# Altium project Artemis_Plus.PrjPcb
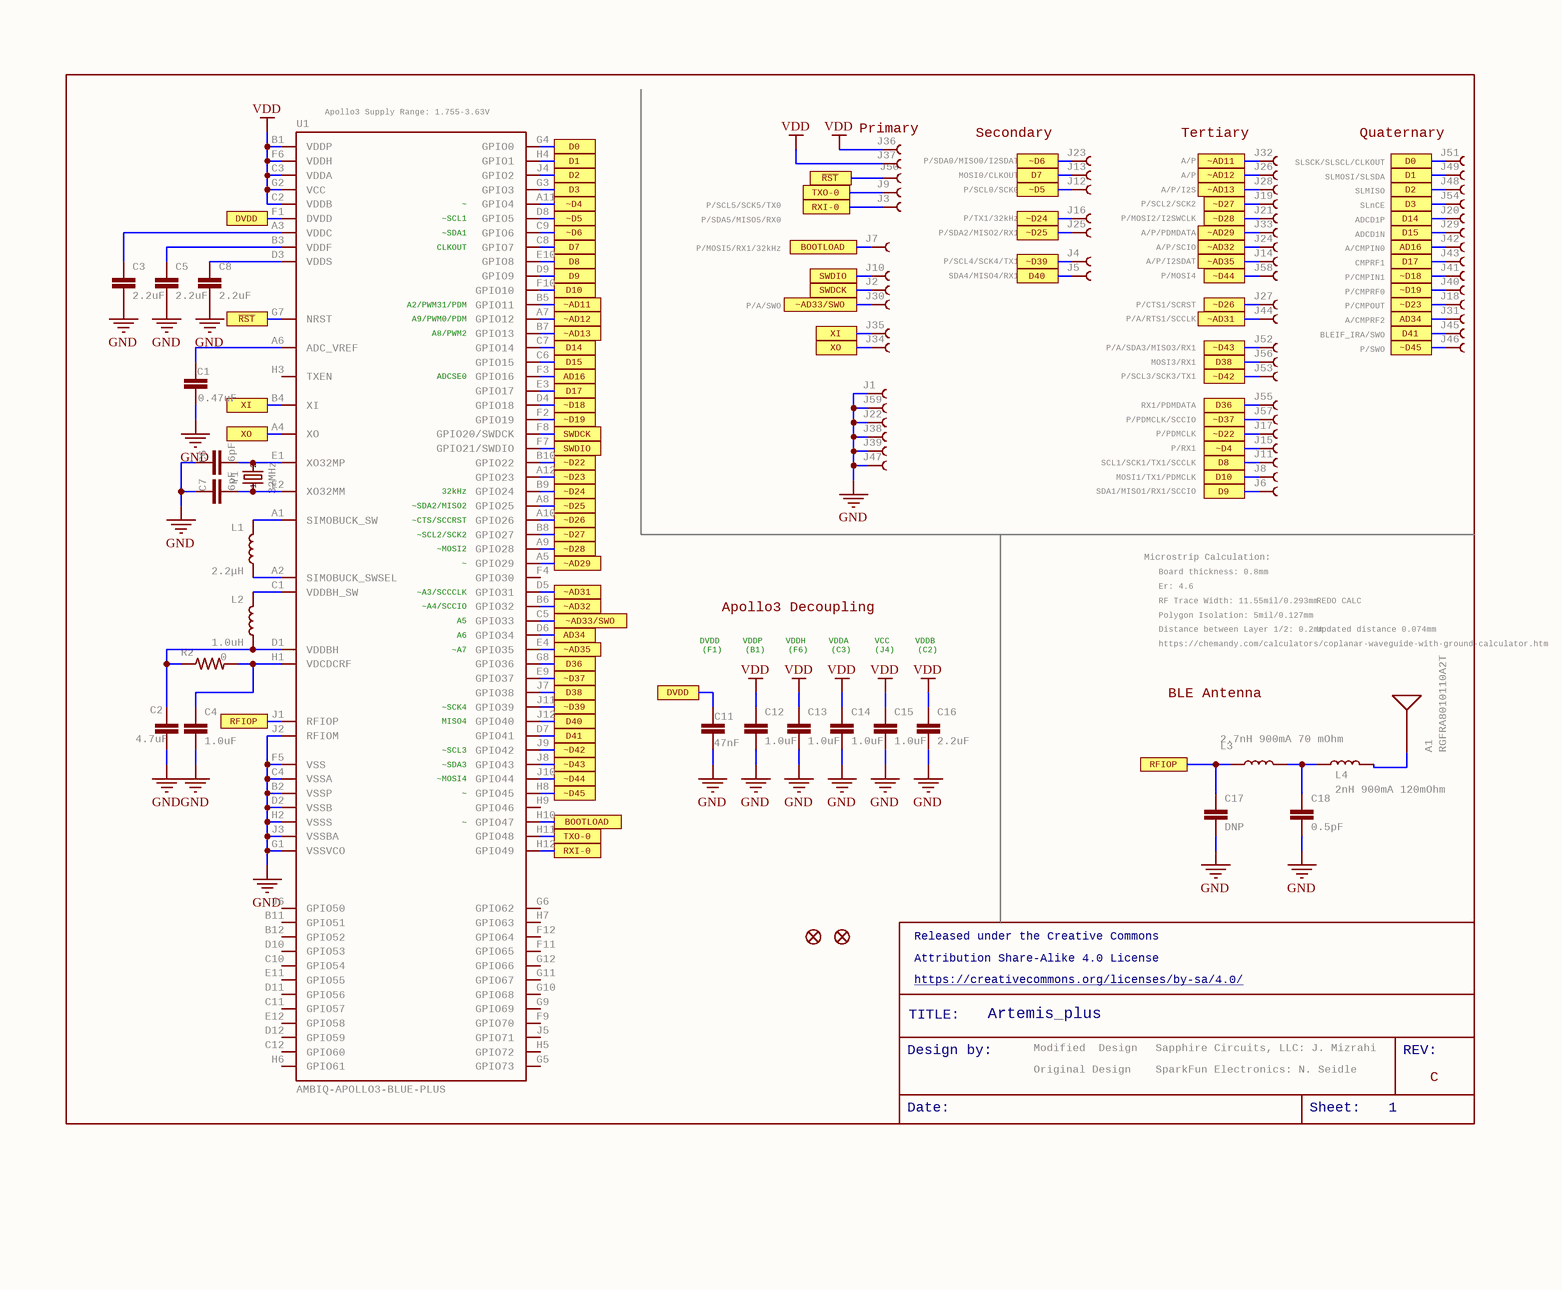
[diagram p0: Artemis_Plus.SchDoc]
CircuitCardAssemblyNumber: 1012; ContactEmail: jared@sapphirecircuits.com; ContactName: Jared Mizrahi; PrintedWireBoardNumber: 1011; Project: SCH, Artemis Plus; ProjectTitle: Artemis Plus; SchematicNumber: 1010; VersionRevision: C
1 sheet, 85 parts. Net scope: global (net labels, ports and power ports of the same name join across sheets).
Board file: Artemis_Plus.PcbDoc

## Sheet Artemis_Plus.SchDoc: Artemis_plus
size 274 x 226 mm; Origin: Eagle; Date: 11/12/2022 4:39:07 PM; SheetNumber: 1; DESIGNER: DESIGNER; REV: REV; GateName_1: G$1; SymbolName_1: FRAME-LETTER; LibraryName: SparkFun-Aesthetics; DeviceSetName: FRAME-LETTER; GateName_2: V; SymbolName_2: DOCFIELD; Sheet: Sheet:; ReleasedundertheCreativeCommons: Released under the Creative Commons; AttributionShare-Alike4.0License: Attribution Share-Alike 4.0 License; https://creativecommons.org/licenses/by-sa/4.0/: https://creativecommons.org/licenses/by-sa/4.0/; Designby: Design by:

### Parts
A1  RGFRA8010110A2T  [RGFRA8010110A2T]
C1  0.47uF  [0402-TIGHT-C]
C2  4.7uF  [0402-TIGHT-C]
C3  2.2uF  [0402-TIGHT-C]
C4  1.0uF  [0402-TIGHT-C]
C5  2.2uF  [0402-TIGHT-C]
C6  6pF  [0402-TIGHT-C]
C7  6pF  [0402-TIGHT-C]
C8  2.2uF  [0402-TIGHT-C]
C11  47nF  [0402-TIGHT-C]
C12  1.0uF  [0402-TIGHT-C]
C13  1.0uF  [0402-TIGHT-C]
C14  1.0uF  [0402-TIGHT-C]
C15  1.0uF  [0402-TIGHT-C]
C16  2.2uF  [0402-TIGHT-C]
C17  DNP  [0402-TIGHT]
C18  0.5pF  [0402-TIGHT-C]
FD1  FIDUCIAL0.4MM  [FIDUCIAL-0.4MM]  (value not drawn)  (no BOM)
FD2  FIDUCIAL0.4MM  [FIDUCIAL-0.4MM]  (value not drawn)  (no BOM)
J1  PAD.4X.6  [MODULE_PAD]  (value not drawn)  (no BOM)
J2  PAD.4X.6  [MODULE_PAD]  (value not drawn)  (no BOM)
J3  PAD.4X.6  [MODULE_PAD]  (value not drawn)  (no BOM)
J4  PAD.4X.6  [MODULE_PAD]  (value not drawn)  (no BOM)
J5  PAD.4X.6  [MODULE_PAD]  (value not drawn)  (no BOM)
J6  PAD.4X.6  [MODULE_PAD]  (value not drawn)  (no BOM)
J7  PAD.4X.6  [MODULE_PAD]  (value not drawn)  (no BOM)
J8  PAD.4X.6  [MODULE_PAD]  (value not drawn)  (no BOM)
J9  PAD.4X.6  [MODULE_PAD]  (value not drawn)  (no BOM)
J10  PAD.4X.6  [MODULE_PAD]  (value not drawn)  (no BOM)
J11  PAD.4X.6  [MODULE_PAD]  (value not drawn)  (no BOM)
J12  PAD.4X.6  [MODULE_PAD]  (value not drawn)  (no BOM)
J13  PAD.4X.6  [MODULE_PAD]  (value not drawn)  (no BOM)
J14  PAD.4X.6  [MODULE_PAD]  (value not drawn)  (no BOM)
J15  PAD.4X.6  [MODULE_PAD]  (value not drawn)  (no BOM)
J16  PAD.4X.6  [MODULE_PAD]  (value not drawn)  (no BOM)
J17  PAD.4X.6  [MODULE_PAD]  (value not drawn)  (no BOM)
J18  PAD.4X.6  [MODULE_PAD]  (value not drawn)  (no BOM)
J19  PAD.4X.6  [MODULE_PAD]  (value not drawn)  (no BOM)
J20  PAD.4X.6  [MODULE_PAD]  (value not drawn)  (no BOM)
J21  PAD.4X.6  [MODULE_PAD]  (value not drawn)  (no BOM)
J22  (no value)  [MODULE_MINI_PAD]  (no BOM)
J23  PAD.4X.6  [MODULE_PAD]  (value not drawn)  (no BOM)
J24  PAD.4X.6  [MODULE_PAD]  (value not drawn)  (no BOM)
J25  PAD.4X.6  [MODULE_PAD]  (value not drawn)  (no BOM)
J26  PAD.4X.6  [MODULE_PAD]  (value not drawn)  (no BOM)
J27  PAD.4X.6  [MODULE_PAD]  (value not drawn)  (no BOM)
J28  PAD.4X.6  [MODULE_PAD]  (value not drawn)  (no BOM)
J29  PAD.4X.6  [MODULE_PAD]  (value not drawn)  (no BOM)
J30  PAD.4X.6  [MODULE_PAD]  (value not drawn)  (no BOM)
J31  PAD.4X.6  [MODULE_PAD]  (value not drawn)  (no BOM)
J32  PAD.4X.6  [MODULE_PAD]  (value not drawn)  (no BOM)
J33  PAD.4X.6  [MODULE_PAD]  (value not drawn)  (no BOM)
J34  PAD.4X.6  [MODULE_PAD]  (value not drawn)  (no BOM)
J35  PAD.4X.6  [MODULE_PAD]  (value not drawn)  (no BOM)
J36  PAD.4X.6  [MODULE_PAD]  (value not drawn)  (no BOM)
J37  PAD.4X.6  [MODULE_PAD]  (value not drawn)  (no BOM)
J38  PAD.6X.6  [MODULE_MINI_PAD]  (value not drawn)  (no BOM)
J39  PAD.4X.6  [MODULE_PAD]  (value not drawn)  (no BOM)
J40  PAD.4X.6  [MODULE_PAD]  (value not drawn)  (no BOM)
J41  PAD.4X.6  [MODULE_PAD]  (value not drawn)  (no BOM)
J42  PAD.4X.6  [MODULE_PAD]  (value not drawn)  (no BOM)
J43  PAD.4X.6  [MODULE_PAD]  (value not drawn)  (no BOM)
J44  PAD.4X.6  [MODULE_PAD]  (value not drawn)  (no BOM)
J45  PAD.4X.6  [MODULE_PAD]  (value not drawn)  (no BOM)
J46  PAD.4X.6  [MODULE_PAD]  (value not drawn)  (no BOM)
J47  PAD.4X.6  [MODULE_PAD]  (value not drawn)  (no BOM)
J48  PAD.4X.6  [MODULE_PAD]  (value not drawn)  (no BOM)
J49  PAD.4X.6  [MODULE_PAD]  (value not drawn)  (no BOM)
J50  PAD.4X.6  [MODULE_PAD]  (value not drawn)  (no BOM)
J51  PAD.4X.6  [MODULE_PAD]  (value not drawn)  (no BOM)
J52  PAD.4X.6  [MODULE_PAD]  (value not drawn)  (no BOM)
J53  PAD.4X.6  [MODULE_PAD]  (value not drawn)  (no BOM)
J54  PAD.4X.6  [MODULE_PAD]  (value not drawn)  (no BOM)
J55  PAD.4X.6  [MODULE_PAD]  (value not drawn)  (no BOM)
J56  PAD.4X.6  [MODULE_PAD]  (value not drawn)  (no BOM)
J57  PAD.4X.6  [MODULE_PAD]  (value not drawn)  (no BOM)
J58  PAD.4X.6  [MODULE_PAD]  (value not drawn)  (no BOM)
J59  PAD.4X.6  [MODULE_PAD]  (value not drawn)  (no BOM)
L1  2.2μH  [DFE201610E-2R2MP2]
L2  1.0uH  [LQM21PN1R0MEHD]
L3  2.7nH 900mA 70 mOhm  [0402-TIGHT-L]
L4  2nH 900mA 120mOhm  [0402-TIGHT-L]
R2  0  [0402-TIGHT-R]
U1  AMBIQ-APOLLO3-BLUE-PLUS  [BGA-104-5.3X4.3MM - Sprite-mixed-0.2-0.19 - 3DModel]
Y1  32MHz  [ECS-320-6-37B2-CKM-TR]

### Ports
AD16, AD34, BOOTLOAD, D0, D1, D2, D3, D7, D8, D9, D10, D14, D15, D17, D36, D38, D40, D41, DVDD, RFIOP, RXI-0, SWDCK, SWDIO, TXO-0, XI, XO, ~AD11, ~AD12, ~AD13, ~AD29, ~AD31, ~AD32, ~AD33/SWO, ~AD35, ~D4, ~D5, ~D6, ~D18, ~D19, ~D22, ~D23, ~D24, ~D25, ~D26, ~D27, ~D28, ~D37, ~D39, ~D42, ~D43, ~D44, ~D45, ~{RST}

### Nets
GND: C1.2 C2.2 C3.2 C4.2 C5.2 C6.1 C7.1 C8.2 C11.2 C12.2 C13.2 C14.2 C15.2 C16.2 C17.2 C18.2 J1.1 J22.1 J38.1 J39.1 J47.1 J59.1 U1.B2(VSSP) U1.C4(VSSA) U1.D2(VSSB) U1.F5(VSS) U1.G1(VSSVCO) U1.H2(VSSS) U1.J2(RFIOM) U1.J3(VSSBA)
VDD: C12.1 C13.1 C14.1 C15.1 C16.1 J36.1 J37.1 U1.B1(VDDP) U1.C2(VDDB) U1.C3(VDDA) U1.F6(VDDH) U1.G2(VCC)
AD16: J42.1 U1.F3(GPIO16) ; port AD16
AD34: J31.1 U1.D6(GPIO34) ; port AD34
BOOTLOAD: J7.1 U1.H10(GPIO47) ; port BOOTLOAD
D0: J51.1 U1.G4(GPIO0) ; port D0
D1: J49.1 U1.H4(GPIO1) ; port D1
D2: J48.1 U1.J4(GPIO2) ; port D2
D3: J54.1 U1.G3(GPIO3) ; port D3
D7: J13.1 U1.C8(GPIO7) ; port D7
D8: J11.1 U1.E10(GPIO8) ; port D8
D9: J6.1 U1.D9(GPIO9) ; port D9
D10: J8.1 U1.F10(GPIO10) ; port D10
D14: J20.1 U1.C7(GPIO14) ; port D14
D15: J29.1 U1.C6(GPIO15) ; port D15
D17: J43.1 U1.E3(GPIO17) ; port D17
D36: J55.1 U1.G8(GPIO36) ; port D36
D38: J56.1 U1.J7(GPIO38) ; port D38
D40: J5.1 U1.J12(GPIO40) ; port D40
D41: J45.1 U1.D7(GPIO41) ; port D41
DVDD: C11.1 U1.F1(DVDD) ; port DVDD
~{RST}: J50.1 U1.G7(NRST) ; port ~{RST}
RFIOP: C17.1 L3.1 U1.J1(RFIOP) ; port RFIOP
RXI-0: J3.1 U1.H12(GPIO49) ; port RXI-0
SWDCK: J2.1 U1.F8(GPIO20/SWDCK) ; port SWDCK
SWDIO: J10.1 U1.F7(GPIO21/SWDIO) ; port SWDIO
TXO-0: J9.1 U1.H11(GPIO48) ; port TXO-0
XI: J35.1 U1.B4(XI) ; port XI
XO: J34.1 U1.A4(XO) ; port XO
~AD11: J32.1 U1.B5(GPIO11) ; port ~AD11
~AD12: J26.1 U1.A7(GPIO12) ; port ~AD12
~AD13: J28.1 U1.B7(GPIO13) ; port ~AD13
~AD29: J33.1 U1.A5(GPIO29) ; port ~AD29
~AD31: J44.1 U1.D5(GPIO31) ; port ~AD31
~AD32: J24.1 U1.B6(GPIO32) ; port ~AD32
~AD33/SWO: J30.1 U1.C5(GPIO33) ; port ~AD33/SWO
~AD35: J14.1 U1.E4(GPIO35) ; port ~AD35
~D4: J15.1 U1.A11(GPIO4) ; port ~D4
~D5: J12.1 U1.D8(GPIO5) ; port ~D5
~D6: J23.1 U1.C9(GPIO6) ; port ~D6
~D18: J41.1 U1.D4(GPIO18) ; port ~D18
~D19: J40.1 U1.F2(GPIO19) ; port ~D19
~D22: J17.1 U1.B10(GPIO22) ; port ~D22
~D23: J18.1 U1.A12(GPIO23) ; port ~D23
~D24: J16.1 U1.B9(GPIO24) ; port ~D24
~D25: J25.1 U1.A8(GPIO25) ; port ~D25
~D26: J27.1 U1.A10(GPIO26) ; port ~D26
~D27: J19.1 U1.B8(GPIO27) ; port ~D27
~D28: J21.1 U1.A9(GPIO28) ; port ~D28
~D37: J57.1 U1.E9(GPIO37) ; port ~D37
~D39: J4.1 U1.J11(GPIO39) ; port ~D39
~D42: J53.1 U1.J9(GPIO42) ; port ~D42
~D43: J52.1 U1.J8(GPIO43) ; port ~D43
~D44: J58.1 U1.J10(GPIO44) ; port ~D44
~D45: J46.1 U1.H8(GPIO45) ; port ~D45
NetA1_FEED: A1.FEED(SIGNAL) L4.2
NetC1_1: C1.1 U1.A6(ADC_VREF)
NetC2_1: C2.1 L2.2 R2.1 U1.D1(VDDBH)
NetC3_1: C3.1 U1.A3(VDDC)
NetC4_1: C4.1 R2.2 U1.H1(VDCDCRF)
NetC5_1: C5.1 U1.B3(VDDF)
NetC6_2: C6.2 U1.E1(XO32MP) Y1.3
NetC7_2: C7.2 U1.E2(XO32MM) Y1.1
NetC8_1: C8.1 U1.D3(VDDS)
NetC18_1: C18.1 L3.2 L4.1
NetL1_1: L1.1 U1.A1(SIMOBUCK_SW)
NetL1_2: L1.2 U1.A2(SIMOBUCK_SWSEL)
NetL2_1: L2.1 U1.C1(VDDBH_SW)

Not connected (* = marked no-connect by the designer): U1 B11(GPIO51) B12(GPIO52) C10(GPIO54) C11(GPIO57) C12(GPIO60) D10(GPIO53) D11(GPIO56) D12(GPIO59) E11(GPIO55) E12(GPIO58) F4(GPIO30) F9(GPIO70) F11(GPIO65) F12(GPIO64) G5(GPIO73) G6(GPIO62) G9(GPIO69) G10(GPIO68) G11(GPIO67) G12(GPIO66) H3(TXEN) H5(GPIO72) H6(GPIO61) H7(GPIO63) H9(GPIO46) J5(GPIO71) J6(GPIO50)

### Notes on the sheet
- (near U1) Apollo3 Supply Range: 1.755-3.63V
- (near J36) Primary
- Secondary
- P/SDA0/MISO0/I2SDAT
- A/P
- Tertiary
- SLSCK/SLSCL/CLKOUT
- Quaternary
- (near U1) ~SCL1
- (near U1) ~SDA1
- (near U1) ~
- P/SCL5/SCK5/TX0
- P/SDA5/MISO5/RX0
- MOSI0/CLKOUT
- P/SCL0/SCK0
- P/TX1/32kHz
- P/SDA2/MISO2/RX1
- A/P/I2S
- P/SCL2/SCK2
- P/MOSI2/I2SWCLK
- A/P/PDMDATA
- SLMOSI/SLSDA
- SLMISO
- SLnCE
- ADCD1P
- ADCD1N
- (near U1) A2/PWM31/PDM
- (near U1) CLKOUT
- P/MOSI5/RX1/32kHz
- P/A/SWO
- P/SCL4/SCK4/TX1
- SDA4/MISO4/RX1
- P/CTS1/SCRST
- A/P/SCIO
- A/P/I2SDAT
- P/MOSI4
- A/CMPIN0
- CMPRF1
- P/CMPIN1
- P/CMPRF0
- P/CMPOUT
- (near U1) ADCSE0
- (near U1) A9/PWM0/PDM
- (near U1) A8/PWM2
- P/A/RTS1/SCCLK
- P/A/SDA3/MISO3/RX1
- MOSI3/RX1
- P/SCL3/SCK3/TX1
- A/CMPRF2
- BLEIF_IRA/SWO
- P/SWO
- RX1/PDMDATA
- P/PDMCLK/SCCIO
- P/PDMCLK
- P/RX1
- (near U1) ~CTS/SCCRST
- (near U1) ~SDA2/MISO2
- (near U1) 32kHz
- SCL1/SCK1/TX1/SCCLK
- MOSI1/TX1/PDMCLK
- SDA1/MISO1/RX1/SCCIO
- (near U1) ~A3/SCCCLK
- (near U1) ~SCL2/SCK2
- (near U1) ~MOSI2
- Microstrip Calculation:
- Board thickness: 0.8mm
- Er: 4.6
- (near U1) A6
- (near U1) ~A4/SCCIO
- (near U1) A5
- (near U1) ~A7
- DVDD
  (F1)
- VDDP
  (B1)
- VDDH
  (F6)
- Apollo3 Decoupling
- VDDA
  (C3)
- VCC
  (J4)
- VDDB
  (C2)
- Distance between Layer 1/2: 0.2mm
- RF Trace Width: 11.55mil/0.293mm
- Polygon Isolation: 5mil/0.127mm
- https://chemandy.com/calculators/coplanar-waveguide-with-ground-calculator.htm
- Updated distance 0.074mm
- REDO CALC
- (near U1) ~SCK4
- (near U1) MISO4
- BLE Antenna
- (near U1) ~SCL3
- (near U1) ~SDA3
- (near U1) ~MOSI4
- Released under the Creative Commons
- TITLE:
- Attribution Share-Alike 4.0 License
- https://creativecommons.org/licenses/by-sa/4.0/
- Artemis_plus
- Design by:
- Original Design
- Modified  Design
- SparkFun Electronics: N. Seidle
- Sapphire Circuits, LLC: J. Mizrahi
- REV:
- Date:
- Sheet:
- 1

### Library data of the parts
A1 = RGFRA8010110A2T: Chip Antenna, 2.45Ghz, Smt Rohs Compliant: Yes |Walsin RGFRA8010110A2T; Manufacturer: Walsin Technologies; Supplier 1: Digi-Key; Supplier Part Number 1: 1292-RGFRA8010110A2TCT-ND; Manufacturer Part Number: RGFRA8010110A2T; RoHS: No; Category: RF Antennas; Stock 1: 5842; Pricing 1: 1=0.36, 10=0.293, 25=0.2684, 100=0.1997, 250=0.181, 500=0.1498, 1000=0.11235 (USD)
C1 = CC0402KRX7R6BB474: Multilayer Ceramic Capacitor, 0.47 uF, 50 V, ± 2%, C0G (NP0), 0402 [1005 Metric]; Manufacturer: Yageo; Material: 4241ConductorMaterial; Value: 470nF; Voltage Rating: 10V; Tolerance: 10%; Dielectric: X7R; Temperature Coefficient: 30ppm/°C; Supplier 1: Digi-Key; Supplier Part Number 1: 13-CC0402KRX7R6BB474CT-ND; Manufacturer Part Number: CC0402KRX7R6BB474; RoHS: Yes; Category: Ceramic Capacitors; Stock 1: 3340; Pricing 1: 10=0.17, 50=0.1022, 100=0.0864, 500=0.05908, 1000=0.05227, 2500=0.05, 5000=0.04545 (USD); Mounting Technology: Surface Mount; Case/Package: 0402; Min Operating Temperature: -55°C; Max Operating Temperature: 125°C; Packaging: Tape and Reel; Voltage Rating (DC): 10V; Series: CC; Length: 0.039inch; Width: 0.02inch; Height: 550um; Thickness: 0.022inch; Lead Free: Lead Free; Halogen Free: Halogen Free; RoHS Compliant: Yes; ComponentLink1URL: http://www.yageo.com/documents/recent/UPY-GPHC_X7R_6.3V-to-50V_18.pdf?src-supplier=Digi-Key; ComponentLink1Description: http://www.yageo.com/documents/recent/UPY-GPHC_X7R_6.3V-to-50V_18.pdf?src-supplier=Digi-Key; ComponentLink2URL: https://datasheet.octopart.com/CC0402KRX7R6BB474-Yageo-datasheet-151948686.pdf?src-supplier=Farnell; ComponentLink2Description: https://datasheet.octopart.com/CC0402KRX7R6BB474-Yageo-datasheet-151948686.pdf?src-supplier=Farnell; ComponentLink3URL: https://datasheet.octopart.com/CC0402KRX7R6BB474-Yageo-datasheet-166511530.pdf?src-supplier=Future+Electronics; ComponentLink3Description: https://datasheet.octopart.com/CC0402KRX7R6BB474-Yageo-datasheet-166511530.pdf?src-supplier=Future+Electronics
C2 = CL05A475MP5NRNC: Multilayer Ceramic Capacitor, 4.7 uF, 10 V, ± 20%, X5R, 0402 [1005 Metric]; Manufacturer: Samsung; Material: 4241ConductorMaterial; Voltage Rating: 10V; Supplier 1: Digi-Key; Supplier Part Number 1: 1276-1482-1-ND; Manufacturer Part Number: CL05A475MP5NRNC; RoHS: Yes; Category: Ceramic Capacitors; Stock 1: 3126621; Pricing 1: 1=0.1, 10=0.068, 50=0.0368, 100=0.0301, 500=0.0215, 1000=0.01689, 2500=0.01535, 5000=0.01412 (USD); Mounting Technology: Surface Mount; Case/Package: 0402; Case Code (Metric): 1005; Case Code (Imperial): 0402; Min Operating Temperature: -55°C; Max Operating Temperature: 85°C; Packaging: Cut Tape; Value: 4.7uF; Tolerance: 20%; Dielectric: X5R; Series: CL; Height: 550um; Lead Free: Lead Free; RoHS Compliant: Yes; ComponentLink1URL: https://datasheet.ciiva.com/25786/cl05a475mp5nrnc-25786963.pdf?src-supplier=Digi-Key; ComponentLink1Description: https://datasheet.ciiva.com/25786/cl05a475mp5nrnc-25786963.pdf?src-supplier=Digi-Key; ComponentLink2URL: https://datasheet.ciiva.com/16437/cl05b104kq5nnnc-16437353.pdf?src-supplier=Future+Electronics; ComponentLink2Description: https://datasheet.ciiva.com/16437/cl05b104kq5nnnc-16437353.pdf?src-supplier=Future+Electronics
C3 C5 C8 C16 = GRM155R61A225KE01D: Multilayer Ceramic Capacitor, 2.2 uF, 10 V, ± 10%, X5R, 0402 [1005 Metric]; Manufacturer: Murata; Supplier 1: Digi-Key; Supplier Part Number 1: 490-GRM155R61A225KE01DCT-ND; Manufacturer Part Number: GRM155R61A225KE01D; RoHS: Yes; Category: Ceramic Capacitors; Stock 1: 9438; Pricing 1: 1=0.1, 10=0.046, 50=0.0252, 100=0.0205, 500=0.01466, 1000=0.01151, 2500=0.01046, 5000=0.00963 (USD); ComponentLink1URL: https://datasheet.octopart.com/GRM155R61A225KE01D-Murata-datasheet-165579666.pdf?src-supplier=TME; ComponentLink1Description: https://datasheet.octopart.com/GRM155R61A225KE01D-Murata-datasheet-165579666.pdf?src-supplier=TME
C4 C12-C15 = GRM155R70J105KA12J: Multilayer Ceramic Capacitor, 1 uF, 6.3 V, ± 10%, X7R, 0402 [1005 Metric]; Manufacturer: Murata; Value: 1uF; Voltage Rating: 6.3V; Supplier 1: Digi-Key; Supplier Part Number 1: 490-13339-1-ND; Manufacturer Part Number: GRM155R70J105KA12J; RoHS: Yes; Category: Ceramic Capacitors; Stock 1: 4901077; Pricing 1: 1=0.1, 10=0.033, 50=0.0178, 100=0.0145, 500=0.01036, 1000=0.00813, 2500=0.00739, 5000=0.0068 (USD); Mounting Technology: Surface Mount; Case/Package: 0402; Pins: 2NUMBER; Case Code (Metric): 1005; Case Code (Imperial): 0402; Weight: 0.000212oz; Min Operating Temperature: -55°C; Max Operating Temperature: 125°C; Packaging: Tape and Reel; Tolerance: 10%; Dielectric: X7R; Termination: SMD/SMT; Voltage Rating (DC): 6.3V; Package Quantity: 50000; Series: GRM; Length: 0.039inch; Width: 0.02inch; Thickness: 0.022inch; RoHS Compliant: Yes; ComponentLink1URL: http://www.mouser.com/ds/2/281/c02e-2905.pdf?src-supplier=Mouser; ComponentLink1Description: http://www.mouser.com/ds/2/281/c02e-2905.pdf?src-supplier=Mouser; ComponentLink2URL: https://datasheet.octopart.com/GRM155R70J105KA12J-Murata-datasheet-32479577.pdf?src-supplier=Future+Electronics; ComponentLink2Description: https://datasheet.octopart.com/GRM155R70J105KA12J-Murata-datasheet-32479577.pdf?src-supplier=Future+Electronics; ComponentLink3URL: https://datasheet.octopart.com/GRM155R70J105KA12J-Murata-datasheet-155345054.pdf?src-supplier=Element14; ComponentLink3Description: https://datasheet.octopart.com/GRM155R70J105KA12J-Murata-datasheet-155345054.pdf?src-supplier=Element14; ComponentLink4URL: http://search.murata.co.jp/Ceramy/image/img/A01X/G101/ENG/GRM155R70J105KA12-01.pdf?src-supplier=Digi-Key; ComponentLink4Description: http://search.murata.co.jp/Ceramy/image/img/A01X/G101/ENG/GRM155R70J105KA12-01.pdf?src-supplier=Digi-Key; ComponentLink5URL: https://datasheet.octopart.com/GRM155R70J105KA12J-Murata-datasheet-165579666.pdf?src-supplier=TME; ComponentLink5Description: https://datasheet.octopart.com/GRM155R70J105KA12J-Murata-datasheet-165579666.pdf?src-supplier=TME
C6 C7 = 0402N6R0D500CT: 0402 6 pF 50 V ±0.5 pF Tolerance C0G/NP0 SMT Multilayer Ceramic Capacitor; Manufacturer: Walsin Technologies; Voltage Rating: 50V; Dielectric: C0G; Supplier 1: Digi-Key; Supplier Part Number 1: 1292-1348-1-ND; Manufacturer Part Number: 0402N6R0D500CT; RoHS: Yes; Category: Ceramic Capacitors; Stock 1: 55050; Pricing 1: 1=0.1, 10=0.024, 50=0.0134, 100=0.0109, 500=0.00778, 1000=0.00611, 2500=0.00556, 5000=0.00511 (USD); Case/Package: 0402; Case Code (Metric): 1005; Case Code (Imperial): 0402; Min Operating Temperature: -55°C; Max Operating Temperature: 125°C; Value: 6pF; Packaging: Tape and Reel; Voltage Rating (DC): 50V; Reach SVHC Compliant: Unknown; RoHS Compliant: Yes; Lead Free: 5697LeadFree; ComponentLink1URL: http://www.farnell.com/datasheets/2340522.pdf?src-supplier=Farnell; ComponentLink1Description: http://www.farnell.com/datasheets/2340522.pdf?src-supplier=Farnell; ComponentLink2URL: http://www.farnell.com/datasheets/1958513.pdf?src-supplier=Farnell; ComponentLink2Description: http://www.farnell.com/datasheets/1958513.pdf?src-supplier=Farnell; ComponentLink3URL: http://www.passivecomponent.com/wp-content/uploads/2018/10/MLCC.pdf?src-supplier=Digi-Key; ComponentLink3Description: http://www.passivecomponent.com/wp-content/uploads/2018/10/MLCC.pdf?src-supplier=Digi-Key; ComponentLink4URL: https://datasheet.octopart.com/0402N6R0D500CT-Walsin-Technologies-datasheet-85392065.pdf?src-supplier=Element14; ComponentLink4Description: https://datasheet.octopart.com/0402N6R0D500CT-Walsin-Technologies-datasheet-85392065.pdf?src-supplier=Element14; ComponentLink5URL: https://datasheet.octopart.com/0402N6R0D500CT-Walsin-Technologies-datasheet-136037192.pdf?src-supplier=TECHDesign; ComponentLink5Description: https://datasheet.octopart.com/0402N6R0D500CT-Walsin-Technologies-datasheet-136037192.pdf?src-supplier=TECHDesign
C11 = GCM155R71C473KA37D: CAP CER 0.047UF 16V 10% X7R 0402; Manufacturer: Murata; Supplier 1: Digi-Key; Supplier Part Number 1: 490-6042-1-ND; Manufacturer Part Number: GCM155R71C473KA37D; RoHS: Yes; Category: Ceramic Capacitors; Stock 1: 635782; Pricing 1: 1=0.1, 10=0.048, 50=0.0262, 100=0.0214, 500=0.01528, 1000=0.01201, 2500=0.01092, 5000=0.01005 (USD); Mounting Technology: Surface Mount; Case/Package: 0402; Case Code (Metric): 1005; Case Code (Imperial): 0402; Min Operating Temperature: -55°C; Max Operating Temperature: 125°C; Value: 47nF; Voltage Rating: 16V; Tolerance: 10%; Packaging: Tape and Reel; Package Quantity: 1; Dielectric: X7R; Voltage Rating (DC): 16V; Termination: SMD/SMT; Series: GCM; Construction: Flat; Length: 1mm; Width: 0.02inch; Height: 0.5mm; Thickness: 0.022inch; Depth: 0.5mm; Ratings: AEC-Q200; Radiation Hardening: No; RoHS Compliant: Yes; ComponentLink1URL: https://datasheet.ciiva.com/11607/product-11607786.pdf?src-supplier=Avnet; ComponentLink1Description: https://datasheet.ciiva.com/11607/product-11607786.pdf?src-supplier=Avnet; ComponentLink2URL: https://datasheet.ciiva.com/6270/s0717e-6270764.pdf?src-supplier=Digi-Key; ComponentLink2Description: https://datasheet.ciiva.com/6270/s0717e-6270764.pdf?src-supplier=Digi-Key; ComponentLink3URL: https://datasheet.ciiva.com/6270/s0717e-6270765.pdf?src-supplier=Digi-Key; ComponentLink3Description: https://datasheet.ciiva.com/6270/s0717e-6270765.pdf?src-supplier=Digi-Key; ComponentLink4URL: https://datasheet.ciiva.com/6270/s0717e-6270766.pdf?src-supplier=Digi-Key; ComponentLink4Description: https://datasheet.ciiva.com/6270/s0717e-6270766.pdf?src-supplier=Digi-Key
C17 = DNP-CAP-0402-TIGHT
C18 = GJM1555C1HR50CB01D: Multilayer Ceramic Capacitor, 0.5 pF, 50 V, ± 0.25pF, C0G (NP0), 0402 [1005 Metric]; Manufacturer: Murata; Voltage Rating: 50V; Supplier 1: Digi-Key; Supplier Part Number 1: 490-3081-1-ND; Manufacturer Part Number: GJM1555C1HR50CB01D; RoHS: Yes; Category: Ceramic Capacitors; Stock 1: 21170; Pricing 1: 1=0.1, 10=0.044, 50=0.024, 100=0.0196, 500=0.01402, 1000=0.01101, 2500=0.01001, 5000=0.00921 (USD); Mounting Technology: Surface Mount; Case/Package: 0402; Case Code (Imperial): 0402; Case Code (Metric): 1005; Min Operating Temperature: -55°C; Max Operating Temperature: 125°C; Value: 0.5pF; Dielectric: C0G; Packaging: Tape and Reel; Package Quantity: 1; Termination: SMD/SMT; Voltage Rating (DC): 50V; Series: GJM; Construction: Flat; Length: 0.039inch; Width: 0.02inch; Height: 0.5mm; Thickness: 0.022inch; Depth: 0.5mm; Radiation Hardening: No; Lead Free: Lead Free; RoHS Compliant: Yes; ComponentLink1URL: https://datasheet.ciiva.com/129/chip20monolithic20cer20caps20c02e-13-129648.pdf?src-supplier=Digi-Key; ComponentLink1Description: https://datasheet.ciiva.com/129/chip20monolithic20cer20caps20c02e-13-129648.pdf?src-supplier=Digi-Key; ComponentLink2URL: https://datasheet.ciiva.com/16440/gjm1555c1hr50cb01d-16440467.pdf?src-supplier=Future+Electronics; ComponentLink2Description: https://datasheet.ciiva.com/16440/gjm1555c1hr50cb01d-16440467.pdf?src-supplier=Future+Electronics; ComponentLink3URL: https://datasheet.ciiva.com/11617/c02e-11617174.pdf?src-supplier=Avnet; ComponentLink3Description: https://datasheet.ciiva.com/11617/c02e-11617174.pdf?src-supplier=Avnet; ComponentLink4URL: https://datasheet.ciiva.com/29541/partnumbering-e-01-29541100.pdf?src-supplier=Digi-Key; ComponentLink4Description: https://datasheet.ciiva.com/29541/partnumbering-e-01-29541100.pdf?src-supplier=Digi-Key; ComponentLink5URL: https://datasheet.ciiva.com/29541/partnumbering-e-01-29541101.pdf?src-supplier=Digi-Key; ComponentLink5Description: https://datasheet.ciiva.com/29541/partnumbering-e-01-29541101.pdf?src-supplier=Digi-Key
FD1 FD2 = FIDUCIAL0.4MM: Fiducial Alignment Points    Point-of-reference for pick-and-place machines and other optical instruments.; GateName_1: G$1; DeviceName: 0.4MM; SymbolName_1: FIDUCIAL; LibraryName: FIDUCIAL; DeviceSetName: FIDUCIAL
J1-J21 J23-J37 J39-J59 = PAD.4X.6: GateName_1: G$1; SymbolName_1: PAD; DeviceName: .4X.6; LibraryName: Module-Pads; DeviceSetName: PAD
J22 J38 = PAD.6X.6: GateName_1: G$1; SymbolName_1: PAD; DeviceName: .6X.6; DeviceSetName: PAD
L1 = DFE201610E-2R2M=P2: Inductor Power Shielded Wirewound 2.2uH 20% 1MHz Metal 1.7A 0.14Ohm DCR 0806 T/R; Manufacturer: Murata; Supplier 1: Digi-Key; Supplier Part Number 1: 490-17728-1-ND; Manufacturer Part Number: DFE201610E-2R2M=P2; RoHS: Yes; Category: Fixed Inductors; Stock 1: 38138; Pricing 1: 1=0.32, 10=0.276, 25=0.2364, 50=0.2166, 100=0.197, 250=0.18512, 500=0.16544, 1000=0.13393 (USD); Case/Package: Metal; RoHS Compliant: Yes; ComponentLink1URL: http://www.farnell.com/datasheets/2339713.pdf?src-supplier=Farnell; ComponentLink1Description: http://www.farnell.com/datasheets/2339713.pdf?src-supplier=Farnell; ComponentLink2URL: https://datasheet.octopart.com/DFE201610E-2R2M%3DP2-Murata-datasheet-90967093.pdf?src-supplier=Element14; ComponentLink2Description: https://datasheet.octopart.com/DFE201610E-2R2M%3DP2-Murata-datasheet-90967093.pdf?src-supplier=Element14; ComponentLink3URL: http://search.murata.co.jp/Ceramy/image/img/P02/J(E)TE243A-0001_DFE201610E_reference.pdf?src-supplier=Digi-Key; ComponentLink3Description: http://search.murata.co.jp/Ceramy/image/img/P02/J(E)TE243A-0001_DFE201610E_reference.pdf?src-supplier=Digi-Key
L2 = LQM21PN1R0MEHD: Inductor Power Chip Shielded Multi-Layer 1uH 20% 1MHz Ferrite 1.6A 0.107Ohm DCR 0805 T/R; Manufacturer: Murata; Saturation Current: 1A; DC Resistance (DCR): 107mR; Self Resonant Frequency: 50MHz; Supplier 1: Digi-Key; Supplier Part Number 1: 490-15984-1-ND; Manufacturer Part Number: LQM21PN1R0MEHD; RoHS: Yes; Category: Fixed Inductors; Stock 1: 16537; Pricing 1: 1=0.22, 10=0.194, 25=0.1668, 50=0.1528, 100=0.1389, 250=0.13056, 500=0.11666, 1000=0.09444 (USD); Mounting Technology: Surface Mount; Case/Package: 0805; Core Material: Ferrite; Case Code (Imperial): 0805; Case Code (Metric): 2012; Min Operating Temperature: -40°C; Max Operating Temperature: 85°C; Packaging: Cut Tape; Value: 1uH; Tolerance: 20%; Current Rating: 1.6A; Shielding: Shielded; Test Frequency: 1MHz; Series: LQM21; RoHS Compliant: Yes; ComponentLink1URL: https://media.digikey.com/pdf/Data%20Sheets/Murata%20PDFs/LQx_Land-Patterns.pdf?src-supplier=Digi-Key; ComponentLink1Description: https://media.digikey.com/pdf/Data%20Sheets/Murata%20PDFs/LQx_Land-Patterns.pdf?src-supplier=Digi-Key; ComponentLink2URL: http://search.murata.co.jp/Ceramy/image/img/P02/JELF243B-0070.pdf?src-supplier=Digi-Key; ComponentLink2Description: http://search.murata.co.jp/Ceramy/image/img/P02/JELF243B-0070.pdf?src-supplier=Digi-Key
L3 = LQG15WZ2N7S02D: IND 2.7NH 900MA 70 MOHM; Manufacturer: Murata; Core Material: Air; Shielding: Unshielded; DC Resistance (DCR): 70mR; Self Resonant Frequency: 6.5GHz; Test Frequency: 100MHz; Supplier 1: Digi-Key; Supplier Part Number 1: 490-15274-1-ND; Manufacturer Part Number: LQG15WZ2N7S02D; RoHS: Yes; Category: Fixed Inductors; Stock 1: 21001; Pricing 1: 1=0.12, 10=0.105, 25=0.0892, 50=0.0788, 100=0.0722, 250=0.06564, 500=0.06172, 1000=0.04727, 2500=0.04464 (USD); Mounting Technology: Surface Mount; Case/Package: 0402; Case Code (Imperial): 0402; Case Code (Metric): 1005; Min Operating Temperature: -55°C; Max Operating Temperature: 125°C; Packaging: Cut Tape; Value: 2.7nH; Current Rating: 900mA; Series: LQG15; Ratings: AEC-Q200; RoHS Compliant: Yes; ComponentLink1URL: http://search.murata.co.jp/Ceramy/image/img/P02/JELF243B-9117.pdf?src-supplier=Digi-Key; ComponentLink1Description: http://search.murata.co.jp/Ceramy/image/img/P02/JELF243B-9117.pdf?src-supplier=Digi-Key
L4 = LQG15HN2N0S02D: FIXED IND 2NH 900MA 120 MOHM SMD; Manufacturer: Murata; Core Material: Air; Q Factor: 8; Current Rating: 300mA; Shielding: Unshielded; Self Resonant Frequency: 6GHz; DC Resistance (DCR): 120mR; Test Frequency: 100MHz; Inductor Type: MONOLITHIC; Supplier 1: Digi-Key; Supplier Part Number 1: 490-6558-1-ND; Manufacturer Part Number: LQG15HN2N0S02D; RoHS: Yes; Category: Fixed Inductors; Stock 1: 59191; Pricing 1: 1=0.1, 10=0.047, 25=0.04, 50=0.0354, 100=0.0325, 250=0.02956, 500=0.02776, 1000=0.02127, 2500=0.02009 (USD); Mounting Technology: Surface Mount; Case/Package: 0402; Pins: 2; Case Code (Metric): 1005; Case Code (Imperial): 0402; Min Operating Temperature: -55°C; Max Operating Temperature: 125°C; Package Quantity: 1; Packaging: Tape and Reel; Value: 2nH; Current: 300mA; Max DC Current: 300mA; Termination: SMD/SMT; DC Current: 300mA; Series: LQG15; Length: 1mm; Width: 0.02inch; Height: 0.5mm; Height - Seated (Max): 0.022inch; Depth: 0.55mm; Reach SVHC Compliant: No; Military Standard: Not; RoHS Compliant: Yes; ComponentLink1URL: https://datasheet.ciiva.com/11799/0900766b8090d3b8-11799042.pdf?src-supplier=Rs; ComponentLink1Description: https://datasheet.ciiva.com/11799/0900766b8090d3b8-11799042.pdf?src-supplier=Rs; ComponentLink2URL: https://datasheet.ciiva.com/4976/o05e-4976477.pdf?src-supplier=Mouser; ComponentLink2Description: https://datasheet.ciiva.com/4976/o05e-4976477.pdf?src-supplier=Mouser; ComponentLink3URL: https://datasheet.ciiva.com/8510/l0075s0083lqg15hn-8510907.pdf?src-supplier=Avnet; ComponentLink3Description: https://datasheet.ciiva.com/8510/l0075s0083lqg15hn-8510907.pdf?src-supplier=Avnet
R2 = RMCF0402ZT0R00: Res Thick Film 0402 0 Ohm Jumper Molded SMD Paper T/R; Manufacturer: Stackpole Electronics; Value: 0R; Power Rating: 63mW; Current Rating: 1A; Working Voltage: 50V; Supplier 1: Digi-Key; Supplier Part Number 1: RMCF0402ZT0R00CT-ND; Manufacturer Part Number: RMCF0402ZT0R00; RoHS: Yes; Category: Chip SMD Resistors; Stock 1: 6411237; Pricing 1: 1=0.1, 10=0.01, 25=0.0076, 50=0.0056, 100=0.0042, 250=0.0032, 500=0.00254, 1000=0.00187, 5000=0.00134 (USD); Mounting Technology: Surface Mount; Case/Package: 0402; Case Code (Metric): 1005; Case Code (Imperial): 0402; Contact Plating: Tin,Matte; Min Operating Temperature: -55°C; Max Operating Temperature: 155°C; Packaging: Tape and Reel; Number of Terminations: 2; Max Power Dissipation: 63mW; Features: Automotive AEC-Q200; Series: RMCF; Technology: THICK FILM; Construction: Rectangular; Voltage Rating: 50V; Length: 0.039inch; Width: 0.02inch; Height: 0.016inch; Depth: 0.5mm; Radiation Hardening: No; Military Standard: Not; RoHS Compliant: Yes; Lead Free: 5697LeadFree; ComponentLink1URL: https://datasheet.ciiva.com/26835/getdatasheetpartid-409751-26835612.pdf?src-supplier=Verical; ComponentLink1Description: https://datasheet.ciiva.com/26835/getdatasheetpartid-409751-26835612.pdf?src-supplier=Verical
U1 = AMA3B2KK-KBR: Apollo3 Blue Plus 96 MHz Cortex M4F, 2048 KB Flash, 768 KB RAM, BLE 5, BGA; Manufacturer: Ambiq Micro; Supplier 1: Digi-Key; Supplier Part Number 1: 5128-AMA3B2KK-KBRCT-ND; Manufacturer Part Number: AMA3B2KK-KBR; RoHS: No; Category: Uncategorized; Stock 1: 2496; Pricing 1: 1=6.61, 10=5.972, 25=5.694, 100=4.944, 250=4.72176, 500=4.30512, 1000=3.74962, 2500=3.61075 (USD)
Y1 = ECS-320-6-37B2-CKM-TR: Crystal 32 Mhz 6PF SMD; Manufacturer: ECS International; Supplier 1: Digi-Key; Supplier Part Number 1: 50-ECS-320-6-37B2-CKM-TRCT-ND; Manufacturer Part Number: ECS-320-6-37B2-CKM-TR; RoHS: No; Category: Uncategorized; Stock 1: 16034; Pricing 1: 1=0.4, 10=0.334, 50=0.3006, 100=0.2673, 500=0.25392, 1000=0.21383 (USD); 1: 1; 2: 2